# EAGLE design canSlaveV05_testboard (EAGLE 6.5.0)
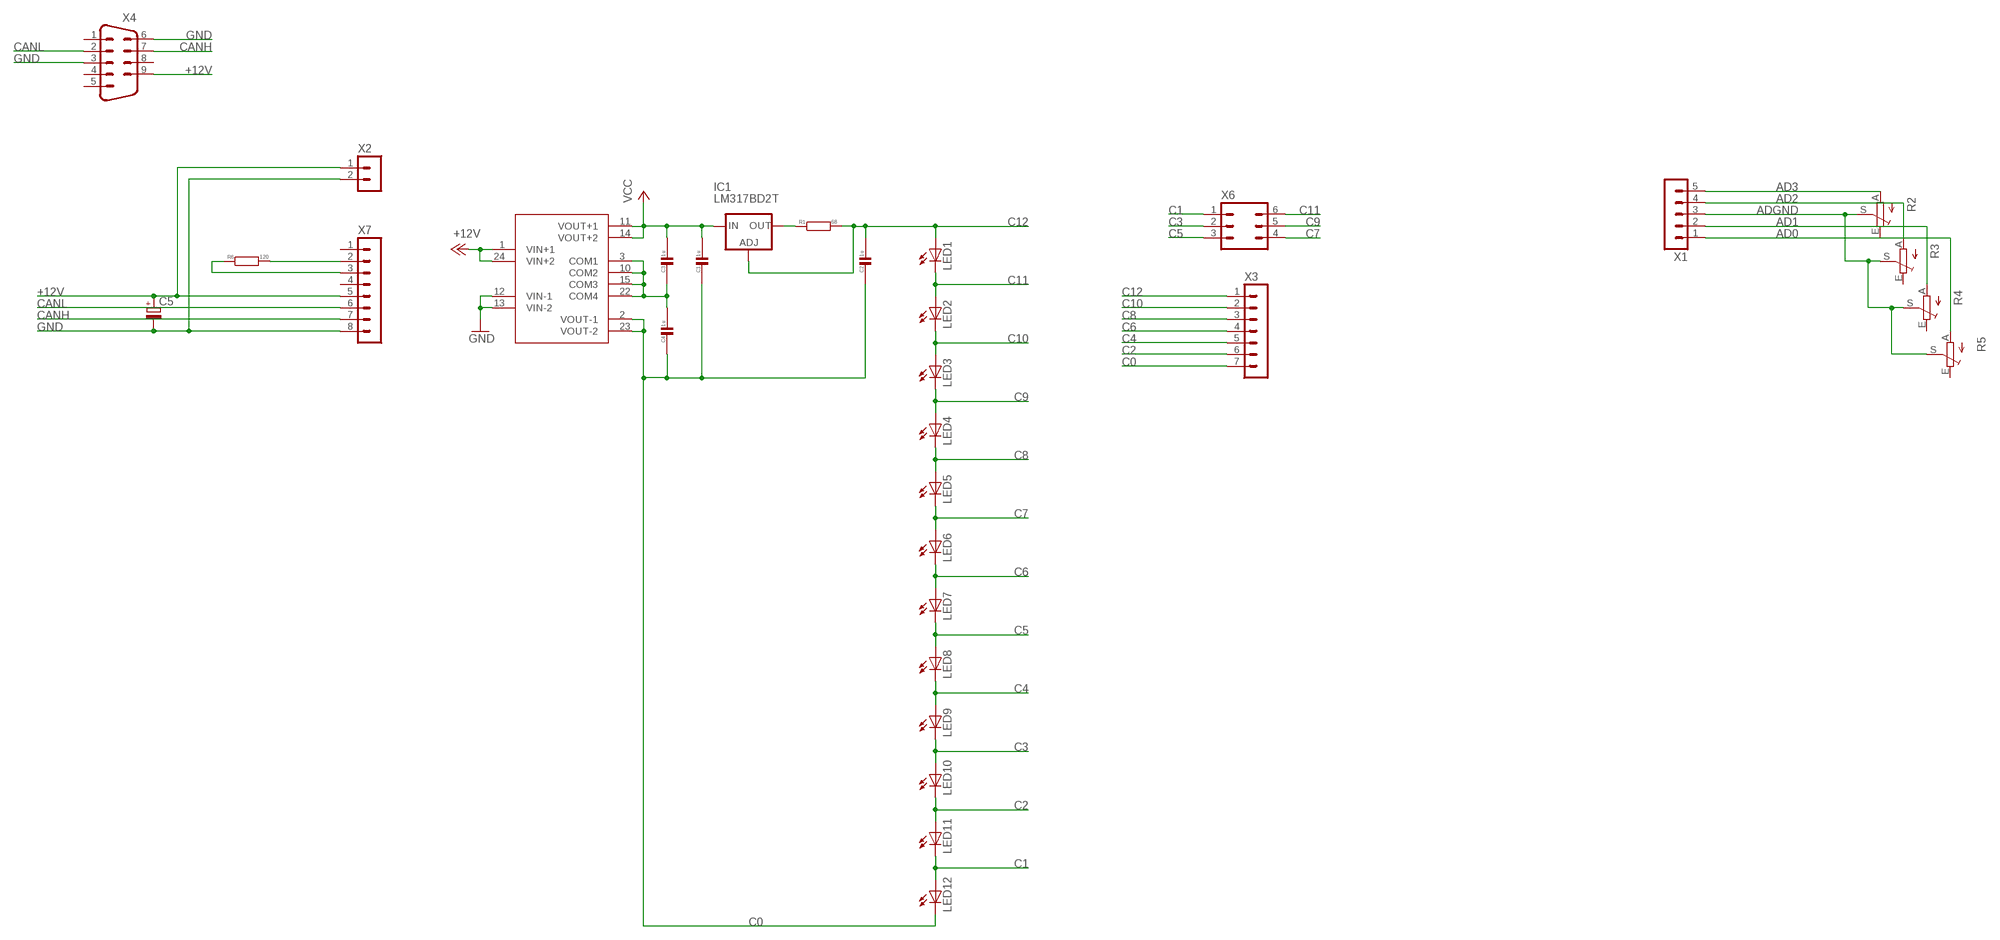
[diagram p0: schematic, sheet 1]

## Parts
C1  1u  C1206  [C1206]
C2  1u  C1206  [C1206]
C3  1u  C1206  [C1206]
C4  1u  C1206  [C1206]
C5  CPOL-EUE10-20  [EB20D]
IC1  LM317BD2T  [D2PACK]
LED1  LEDSMT1206  [1206]
LED2  LEDSMT1206  [1206]
LED3  LEDSMT1206  [1206]
LED4  LEDSMT1206  [1206]
LED5  LEDSMT1206  [1206]
LED6  LEDSMT1206  [1206]
LED7  LEDSMT1206  [1206]
LED8  LEDSMT1206  [1206]
LED9  LEDSMT1206  [1206]
LED10  LEDSMT1206  [1206]
LED11  LEDSMT1206  [1206]
LED12  LEDSMT1206  [1206]
R1  68  R1206  [R1206]
R2  TRIM_EU-CIP20C-6MM  [CIP20C-6MM]
R3  TRIM_EU-CIP20C-6MM  [CIP20C-6MM]
R4  TRIM_EU-CIP20C-6MM  [CIP20C-6MM]
R5  TRIM_EU-CIP20C-6MM  [CIP20C-6MM]
R6  120  R1206  [R1206]
U$1  JCB0312D24  [JCB03]
X1  HEADER_POS5_43650-0515  [43650-0515]
X2  HEADER_POS2_43650-0215  [43650-0215]
X3  HEADER_POS7_43650-0715  [43650-0715]
X4  M09HP  [M09HP]
X6  HEADER_POS6_43650-0615  [43650-0615]
X7  HEADER_POS8_43045-0812  [43045-0812]

## Nets
+12V: C5.+ U$1.1(VIN+1) U$1.24(VIN+2) X2.1 X4.9 X7.5
AD0: R5.A X1.1
AD1: R4.A X1.2
AD2: R3.A X1.4
AD3: R2.A X1.5
ADGND: R2.S R3.S R4.S R5.S X1.3
C0: C1.2 C2.2 C4.2 LED12.C U$1.2(VOUT-1) U$1.23(VOUT-2) X3.7
C1: LED11.C LED12.A X6.1
C2: LED10.C LED11.A X3.6
C3: LED9.C LED10.A X6.2
C4: LED8.C LED9.A X3.5
C5: LED7.C LED8.A X6.3
C6: LED6.C LED7.A X3.4
C7: LED5.C LED6.A X6.4
C8: LED4.C LED5.A X3.3
C9: LED3.C LED4.A X6.5
C10: LED2.C LED3.A X3.2
C11: LED1.C LED2.A X6.6
C12: C2.1 IC1.1(ADJ) LED1.A R1.2 X3.1
CANH: X4.7 X7.7
CANL: X4.2 X7.6
CANR1: R6.1 X7.3
CANR2: R6.2 X7.2
COMM: C3.2 C4.1 U$1.3(COM1) U$1.10(COM2) U$1.15(COM3) U$1.22(COM4)
GND: C5.- U$1.12(VIN-1) U$1.13(VIN-2) X2.2 X4.3 X4.6 X7.8
LM317O: IC1.2(OUT) R1.1
VCC: C1.1 C3.1 IC1.3(IN) U$1.11(VOUT+1) U$1.14(VOUT+2)
Unconnected: R2.E R3.E R4.E R5.E X4.1 X4.4 X4.5 X4.8 X7.1 X7.4

## Library data of the parts
C1-C4 = phrenetic:C
C5 = rcl:CPOL-EU: POLARIZED CAPACITOR, European symbol
IC1 = v-reg:LM317?*: 500 mA Adjustable Output Positive Voltage Regulator Source: http://www.onsemi.co.jp .. LM317M-D.PDF
LED1-LED12 = led:LED: LED OSRAM: - CHIPLED LG R971, LG N971, LY N971, LG Q971, LY Q971, LO R971, LY R971 LH N974, LH R974 LS Q976, LO Q976, LY Q976 LO Q996 - Hyper CHIPLED LW Q18S LB Q993, LB Q99A, LB R99A - SideLED LS A670, LO A670, LY A670, LG A670, LP A670 LB A673, LV A673, LT A673, LW A673 LH A674 LY A675 LS A676, LA A676, LO A676, LY A676, LW A676 LS A679, LY A679, LG A679 - Hyper Micro SIDELED® LS Y876, LA Y876, LO Y876, LY Y876 LT Y87S - SmartLED LW L88C, LW L88S LB L89C, LB L89S, LG L890 LS L89K, LO L89K, LY L89K LS L896, LA L896, LO L896, LY L896 - TOPLED LS T670, LO T670, LY T670, LG T670, LP T670 LSG T670, LSP T670, LSY T670, LOP T670, LYG T670 LG T671, LOG T671, LSG T671 LB T673, LV T673, LT T673, LW T673 LH T674 LS T676, LA T676, LO T676, LY T676, LB T676, LH T676, LSB T676, LW T676 LB T67C, LV T67C, LT T67C, LS T67K, LO T67K, LY T67K, LW E67C LS E67B, LA E67B, LO E67B, LY E67B, LB E67C, LV E67C, LT E67C LW T67C LS T679, LY T679, LG T679 LS T770, LO T770, LY T770, LG T770, LP T770 LB T773, LV T773, LT T773, LW T773 LH T774 LS E675, LA E675, LY E675, LS T675 LS T776, LA T776, LO T776, LY T776, LB T776 LHGB T686 LT T68C, LB T68C - Hyper Mini TOPLED® LB M676 - Mini TOPLED Santana® LG M470 LS M47K, LO M47K, LY M47K Source: http://www.osram.convergy.de LUXEON: - LUMILED® LXK2-PW12-R00, LXK2-PW12-S00, LXK2-PW14-U00, LXK2-PW14-V00 LXK2-PM12-R00, LXK2-PM12-S00, LXK2-PM14-U00 LXK2-PE12-Q00, LXK2-PE12-R00, LXK2-PE12-S00, LXK2-PE14-T00, LXK2-PE14-U00 LXK2-PB12-K00, LXK2-PB12-L00, LXK2-PB12-M00, LXK2-PB14-N00, LXK2-PB14-P00, LXK2-PB14-Q00 LXK2-PR12-L00, LXK2-PR12-M00, LXK2-PR14-Q00, LXK2-PR14-R00 LXK2-PD12-Q00, LXK2-PD12-R00, LXK2-PD12-S00 LXK2-PH12-R00, LXK2-PH12-S00 LXK2-PL12-P00, LXK2-PL12-Q00, LXK2-PL12-R00 Source: www.luxeon.com KINGBRIGHT: KA-3528ASYC Source: www.kingbright.com
R1 R6 = phrenetic:R: RESISTOR, Bla
R2-R5 = pot:TRIM_EU-: POTENTIOMETER
U$1 = bms-hsrm:JCB0312D24
X1 = con-molex-micro-fit-3_0:HEADER_POS5_?: Molex - Micro-Fit 3.0 Series connector, 3.00mm (0.118") pitch header, 5 positions.
X2 = con-molex-micro-fit-3_0:HEADER_POS2_?: Molex - Micro-Fit 3.0 Series connector, 3.00mm (0.118") pitch header, 2 positions.
X3 = con-molex-micro-fit-3_0:HEADER_POS7_?: Molex - Micro-Fit 3.0 Series connector, 3.00mm (0.118") pitch header, 7 positions.
X4 = con-subd:M09: SUB-D; OC_FARNELL: unknown; OC_NEWARK: unknown
X6 = con-molex-micro-fit-3_0:HEADER_POS6_?: Molex - Micro-Fit 3.0 Series connector, 3.00mm (0.118") pitch header, 6 positions.
X7 = con-molex-micro-fit-3_0:HEADER_POS8_?: Molex - Micro-Fit 3.0 Series connector, 3.00mm (0.118") pitch header, 8 positions.

## Board
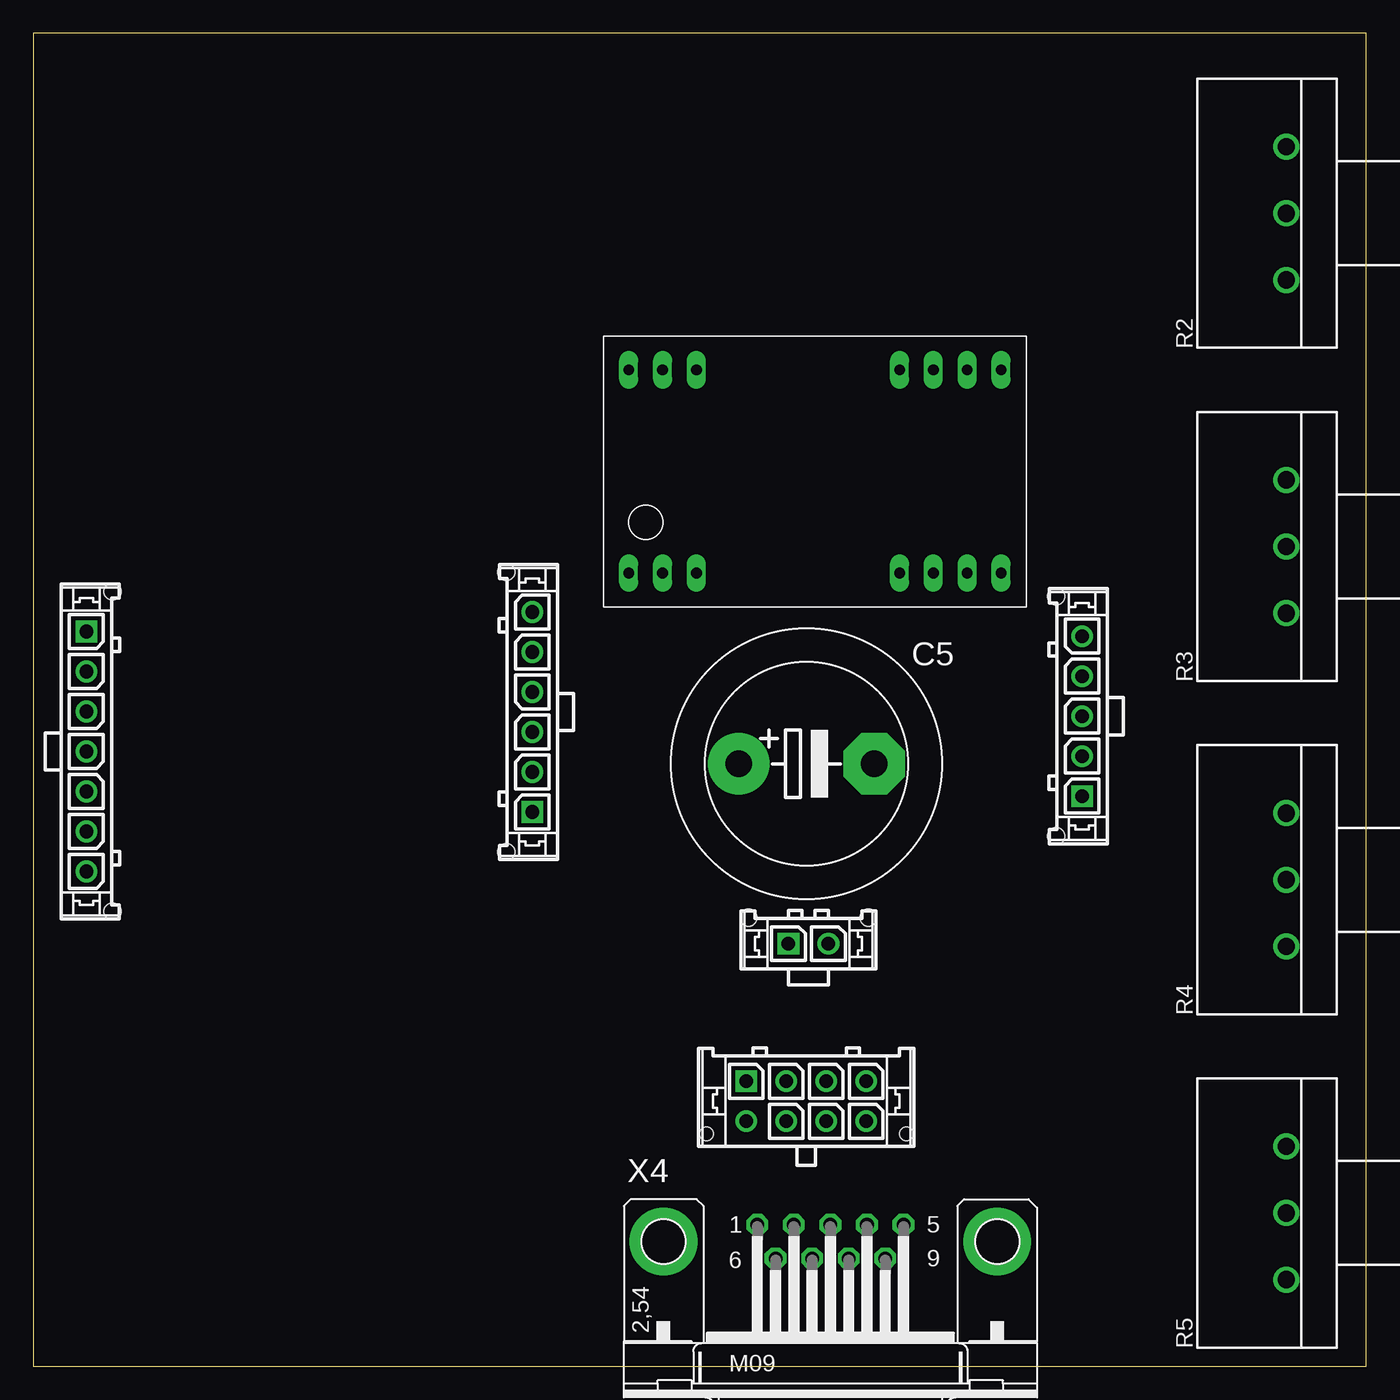
[diagram p1: board, top side]
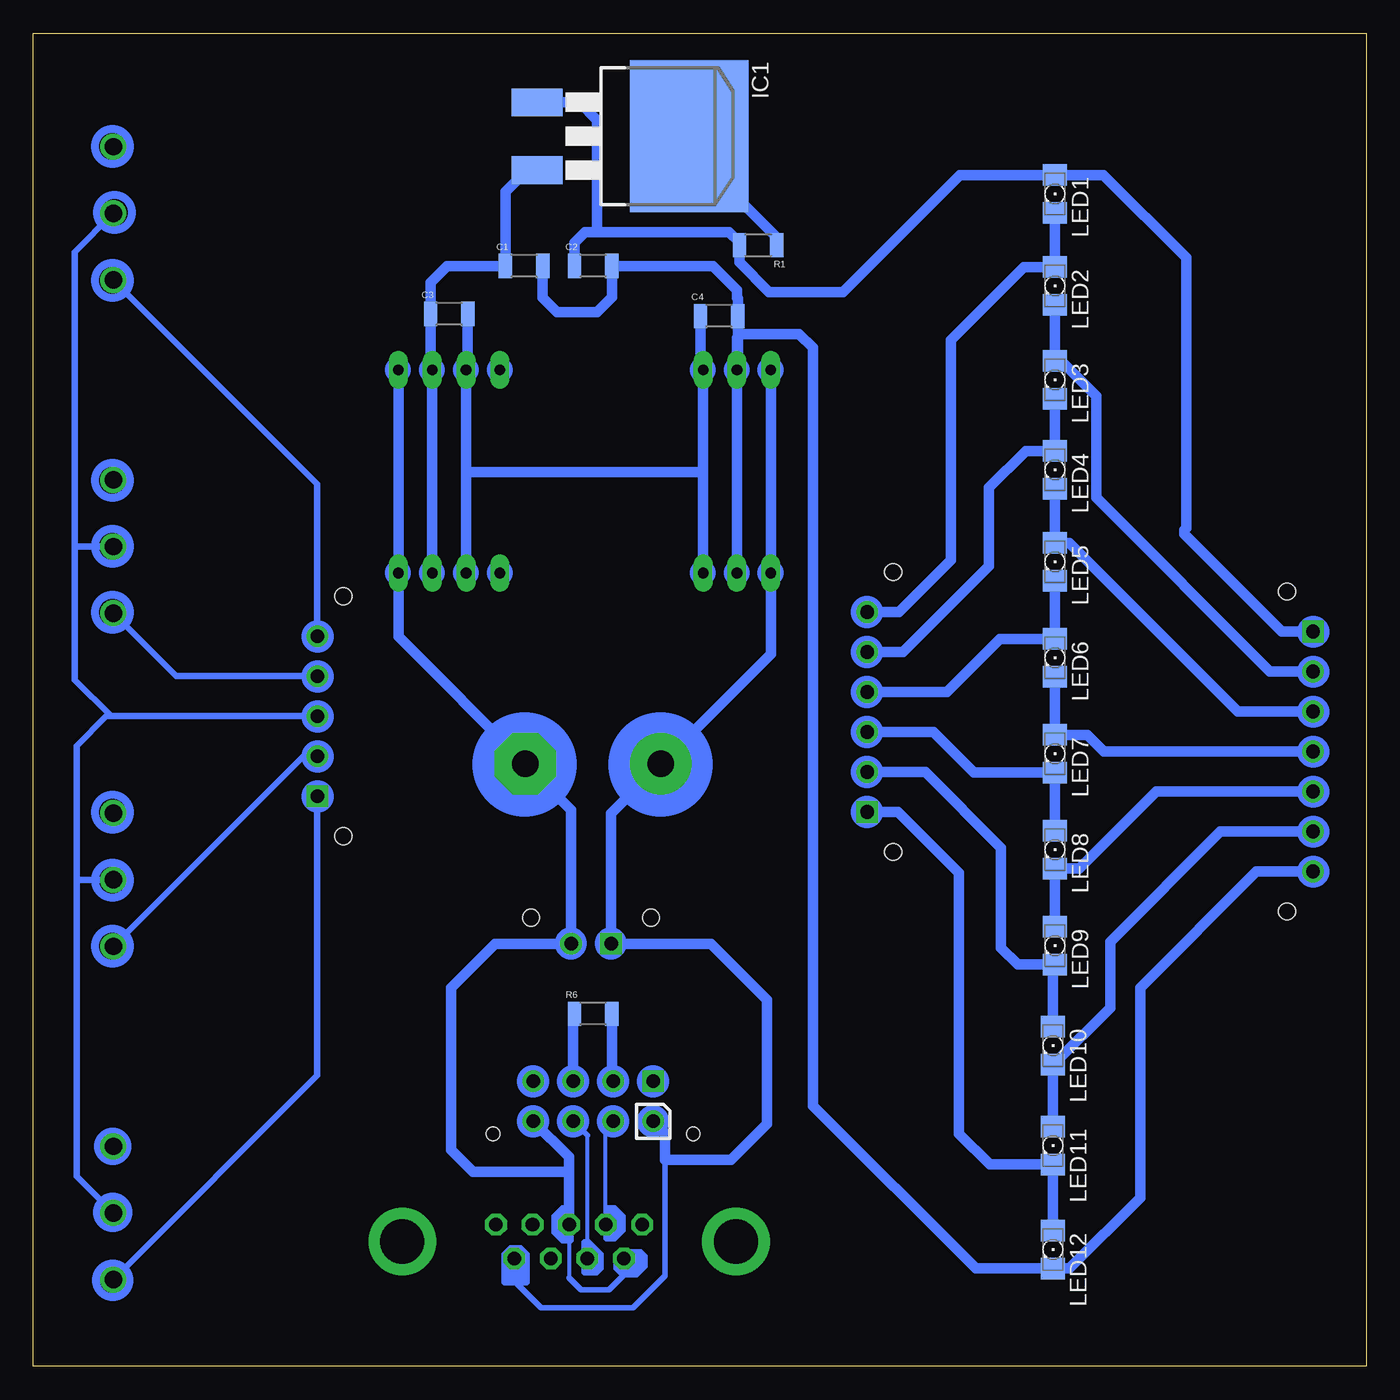
[diagram p2: board, bottom side, seen from below]

Size 100 x 100 mm. Coordinates in mm from the lower left corner, seen from the top.
Outline: 0,0 100,0 100,100 0,100 0,0
Copper layers (1*16): Top 0.035mm / dielectric 1.5mm / Bottom 0.035mm
Design rules "default *": minimum track width 12mil, minimum drill 24mil, track to track 16mil, track to pad 16mil, pad to pad 16mil, via to via 16mil, smd to smd 0mil, copper to edge 40mil, drill to drill 8mil, minimum pad ring 12mil, minimum via ring 8mil, stop-mask expansion 4mil, vias tented up to drill 0mil, thermal gap 10mil

### Footprints (pad centres in the part's own frame; a part is rotated, then mirrored left to right if it is on the bottom)
C1206 = smd 1 x 1.8: 1 -1.4,0; 2 1.4,0
EB20D = drill 2.007 pad 4.597: + -5.08,0 | drill 2.007 pad 4.597 octagon: - 5.08,0
D2PACK = smd 2.083 x 3.81: 1 -2.54,-8.89; 3 2.54,-8.89 | smd 11.43 x 8.89: 2 0,2.54
1206 = smd 1.6 x 1.803: A -1.422,0; C 1.422,0
R1206 = smd 1 x 1.8: 1 -1.4,0; 2 1.4,0
CIP20C-6MM = drill 1.3 pad 1.93: A -5,0; E 5,0; S 0,0
JCB03 = drill 0.8 pad 1.27 long: 1 -13.97,-7.62; 2 -11.43,-7.62; 3 -8.89,-7.62; 9 6.35,-7.62; 10 8.89,-7.62; 11 11.43,-7.62; 12 13.97,-7.62; 13 13.97,7.62; 14 11.43,7.62; 15 8.89,7.62; 16 6.35,7.62; 22 -8.89,7.62; 23 -11.43,7.62; 24 -13.97,7.62
43650-0515 = drill 1.02 square: 1 6,0 | drill 1.02: 2 3,0; 3 0,0; 4 -3,0; 5 -6,0 | hole 1.27: 9,-1.96; -9,-1.96
43650-0215 = drill 1.02 square: 1 1.5,0 | drill 1.02: 2 -1.5,0 | hole 1.27: 4.5,-1.96; -4.5,-1.96
43650-0715 = drill 1.02 square: 1 9,0 | drill 1.02: 2 6,0; 3 3,0; 4 0,0; 5 -3,0; 6 -6,0; 7 -9,0 | hole 1.27: 12,-1.96; -12,-1.96
M09HP = drill 1.016 octagon: 1 -5.486,1.27; 2 -2.743,1.27; 3 0,1.27; 4 2.743,1.27; 5 5.486,1.27; 6 -4.115,-1.27; 7 -1.372,-1.27; 8 1.372,-1.27; 9 4.115,-1.27 | drill 3.302 pad 5.08: G1 -12.522,0; G2 12.522,0
43650-0615 = drill 1.02 square: 1 7.5,0 | drill 1.02: 2 4.5,0; 3 1.5,0; 4 -1.5,0; 5 -4.5,0; 6 -7.5,0 | hole 1.27: 10.5,-1.96; -10.5,-1.96
43045-0812 = drill 1.02 square: 1 4.5,0 | drill 1.02: 2 1.5,0; 3 -1.5,0; 4 -4.5,0; 5 4.5,3; 6 1.5,3; 7 -1.5,3; 8 -4.5,3 | hole 1.02: 7.5,3.94; -7.5,3.94

### Placement (x,y rotation side)
C1  63.18,82.55 0 bottom
C2  58,82.55 0 bottom
C3  68.8,78.95 0 bottom
C4  48.55,78.8 0 bottom
C5  58,45.2 0 top
IC1  53.32,92.28 270 bottom
LED1  23.35,87.95 270 bottom
LED2  23.35,81.05 270 bottom
LED3  23.35,74 270 bottom
LED4  23.35,67.25 270 bottom
LED5  23.35,60.35 270 bottom
LED6  23.35,53.15 270 bottom
LED7  23.35,45.95 270 bottom
LED8  23.35,38.75 270 bottom
LED9  23.35,31.55 270 bottom
LED10  23.5,24.05 270 bottom
LED11  23.5,16.55 270 bottom
LED12  23.5,8.75 270 bottom
R1  45.62,84.1 180 bottom
R2  94,86.5 90 top
R3  94,61.5 90 top
R4  94,36.5 90 top
R5  94,11.5 90 top
R6  58,26.45 0 bottom
U$1  58.64,67.13 0 top
X1  78.69,48.77 270 top
X2  58.15,31.7 180 top
X3  3.98,46.12 90 top
X4  59.8,9.35 0 top
X6  37.44,49.08 270 top
X7  57.99,21.38 180 top

### Tracks (layer width: path | path; a pad name or v marks a point on that pad's centre or on a via)
+12V
  Bottom 0.4: X4.9 63.91,6.42 61.9,4.4 55,4.4 52.6,6.8 52.6,15.5
  Bottom 0.8: X7.5 52.6,17.49 52.6,15.5 47.65,15.5 44.95,18.2 44.95,27.5 49.15,31.7 X2.1 56.65,41.47 C5.+ 44.67,53.45 U$1.1 U$1.24
AD0
  Bottom 0.5: X1.1 78.69,21.81 R5.A
AD1
  Bottom 0.5: X1.2 79.73,45.77 R4.A
AD2
  Bottom 0.5: X1.4 89.27,51.77 R3.A
AD3
  Bottom 0.5: X1.5 78.69,66.19 R2.A
ADGND
  Bottom 0.5: X1.3 94.17,48.77 | 94.17,48.77 96.9,51.5 96.9,61.55 | 96.9,61.55 96.9,83.6 R2.S | R3.S 96.85,61.5 96.9,61.55 | 94.17,48.77 94.53,48.77 96.75,46.55 96.75,36.5 | 96.75,36.5 96.75,14.25 R5.S | R4.S 96.75,36.5
C0
  Bottom 0.8: C1.2 61.78,80.18 60.7,79.1 57.7,79.1 56.6,80.2 C2.2 49,82.55 47.2,80.75 47.2,80.15 47.15,80.1 C4.2 47.15,75.7 47.35,75.5 47.21,75.36 U$1.23 U$1.2 47.21,77.14 46.9,77.45 42.55,77.45 41.5,76.4 41.5,19.55 29.28,7.33 LED12.C 22.27,7.33 16.95,12.65 16.95,28.4 8.23,37.12 X3.7
C1
  Bottom 0.8: LED12.A LED11.C 28.23,15.13 30.55,17.45 30.55,37 35.13,41.58 X6.1
C2
  Bottom 0.8: X3.6 10.93,40.12 19.2,31.85 19.2,26.9 23.47,22.63 LED10.C LED11.A
C3
  Bottom 0.8: LED10.A 23.5,29.98 LED9.C 26.13,30.13 27.4,31.4 27.4,38.9 33.08,44.58 X6.2
C4
  Bottom 0.8: X3.5 15.73,43.12 21.52,37.33 LED8.C LED9.A
C5
  Bottom 0.8: LED8.A LED7.C 29.43,44.53 32.48,47.58 X6.3
C6
  Bottom 0.8: X3.4 19.67,46.12 20.92,47.37 LED7.A LED6.C
C7
  Bottom 0.8: LED5.C LED6.A 27.48,54.57 31.47,50.58 X6.4
C8
  Bottom 0.8: LED4.C LED5.A 22.27,61.77 9.62,49.12 X3.3
C9
  Bottom 0.8: LED3.C LED4.A 25.53,68.67 28.3,65.9 28.3,60.05 34.77,53.58 X6.5
C10
  Bottom 0.8: LED2.C LED3.A 22.87,75.42 20.25,72.8 20.25,65.15 7.22,52.12 X3.2
C11
  Bottom 0.8: LED1.C LED2.A 25.68,82.47 31.15,77 31.15,60.5 35.07,56.58 X6.6
C12
  Bottom 0.8: C2.1 59.4,84.3 58.6,85.1 57.85,85.1 | 57.85,85.1 47.8,85.1 47.02,84.32 R1.2 47.02,82.82 44.8,80.6 39.25,80.6 30.48,89.37 LED1.A 19.72,89.37 13.5,83.15 13.5,62.9 13.65,62.75 13.65,62.45 6.32,55.12 X3.1 | IC1.1 59.02,94.82 57.7,93.5 57.7,85.25 57.85,85.1
CANH
  Bottom 0.3: X4.7 58.43,17.32
  Bottom 0.4: 58.43,17.32 X7.7
CANL
  Bottom 0.3: X4.2 57.06,17.81
  Bottom 0.4: 57.06,17.81 X7.6
CANR1
  Bottom 0.8: X7.3 59.49,26.36 R6.1
CANR2
  Bottom 0.4: 56.6,21.49 X7.2
  Bottom 0.8: R6.2 56.6,21.49
COMM
  Bottom 0.8: U$1.10 67.53,67.1 | 67.53,67.1 U$1.15 67.4,74.88 C3.2 | U$1.3 49.75,67.1 49.9,67.1 | 49.9,67.1 67.53,67.1 | 49.9,67.1 49.75,67.25 U$1.22 49.95,74.95 C4.1
GND
  Bottom 0.3: X4.3 59.8,6.65
  Bottom 0.4: X4.6 55.69,6.87 56.8,5.75 58.9,5.75 59.8,6.65 | 59.95,14.6 59.8,14.45 | C5.- 63.08,45.18
  Bottom 0.8: X4.3 59.8,14.45 59.8,15.69 X7.8 | 59.95,14.6 67,14.6 68.65,16.25 68.65,28.4 65.35,31.7 X2.2 59.65,41.75 63.08,45.18 | U$1.13 U$1.12 72.61,54.73 C5.-
LM317O
  Bottom 0.8: R1.1 44.22,84.67 50.78,91.23 IC1.2
N$1
  Bottom 0.5: 57,9.75 56.55,9.75 56.1,10.2 56.1,11.1 56.55,11.55 57,11.55 57,11.85 56.4,11.85 55.8,11.25 55.8,10.2 56.4,9.6 57,9.6
N$2
  Bottom 0.5: 59.85,11.85 60.3,11.85 60.9,11.25 60.9,10.05 60.3,9.45 59.7,9.45 59.7,11.7 59.7,11.85 59.85,11.85 | 59.85,11.85 60.75,10.95 60.75,10.05 60.45,10.05 60.15,9.75
N$3
  Bottom 0.5: 55.65,8.55 54.9,8.55 | 54.9,8.55 54.6,8.25 54.6,7.65 55.2,7.05 55.8,7.05 56.1,7.35 55.35,7.35 54.9,7.8 54.9,8.55 | 54.9,8.55 54.45,8.55 54.15,8.25 54.15,7.5 54.6,7.05 54.75,7.05 54.9,6.9 | 54.9,6.9 54.75,6.9 | 54.9,6.9 55.8,6.9 56.25,7.35 56.25,8.25
N$4
  Bottom 0.5: 58.35,9.3 57.45,8.4 57.45,7.35 57.75,7.05 58.65,7.05 58.65,9.3 57.75,8.4 57.75,7.5 57.9,7.35
N$5
  Bottom 0.5: 64.65,6.9 64.65,6.3 63,6.3 63,8.4 63.45,8.85 64.2,8.85 64.65,8.4 64.65,6.9 | 64.65,6.9 64.35,6.6 63.15,6.6 63.15,7.5 64.5,7.5 64.5,7.05 63.3,7.05
VCC
  Bottom 0.8: U$1.11 U$1.14 70.2,74.88 C3.1 70.2,81.3 68.95,82.55 C1.1 64.58,88.12 62.96,89.74 IC1.3
(copper drawn outside any net)
  shapes: Bottom circle x56